# EAGLE design XC9536_trainer (EAGLE 7.5.0)
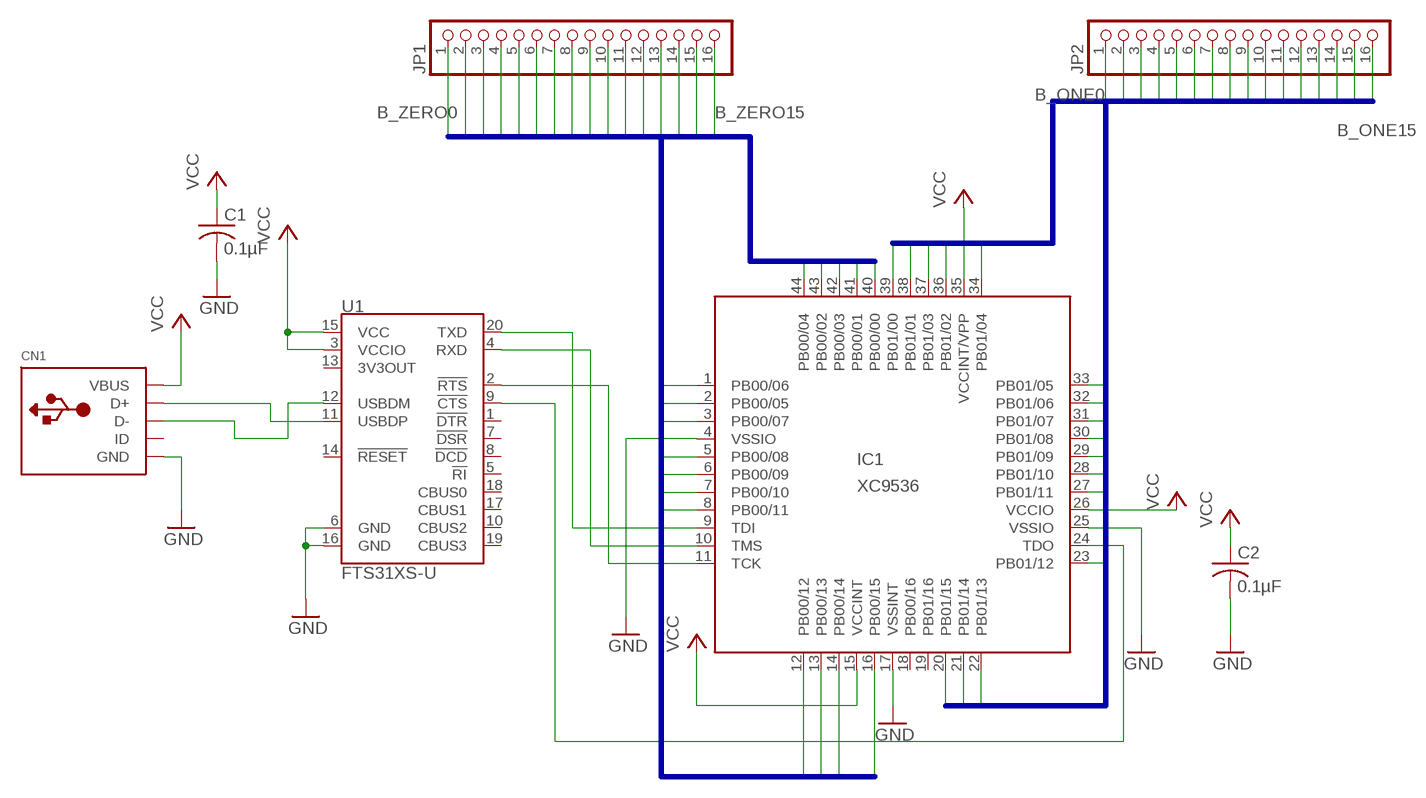
[diagram p0: schematic, sheet 1]

## Parts
C1  0.1µF  C-USC0603K  [C0603K]
C2  0.1µF  C-USC0603K  [C0603K]
CN1  USBMINIBLARGE  [USB-MINIB_LARGER]
IC1  XC9536  XC9536_44VQ  [SQFP-S-10X10-44]
JP1  HEADER-1X16ROUND  [1X16_ROUND]
JP2  HEADER-1X16ROUND  [1X16_ROUND]
U1  FTS31XS-U  FT231XS  [SSOP20_L]

## Nets
B_ONE0: IC1.39(PB01/00) JP2.1
B_ONE1: IC1.38(PB01/01) JP2.2
B_ONE2: IC1.36(PB01/02) JP2.3
B_ONE3: IC1.37(PB01/03) JP2.4
B_ONE4: IC1.34(PB01/04) JP2.5
B_ONE5: IC1.33(PB01/05) JP2.6
B_ONE6: IC1.32(PB01/06) JP2.7
B_ONE7: IC1.31(PB01/07) JP2.8
B_ONE8: IC1.30(PB01/08) JP2.9
B_ONE9: IC1.29(PB01/09) JP2.10
B_ONE10: IC1.28(PB01/10) JP2.11
B_ONE11: IC1.27(PB01/11) JP2.12
B_ONE12: IC1.23(PB01/12) JP2.13
B_ONE13: IC1.22(PB01/13) JP2.14
B_ONE14: IC1.21(PB01/14) JP2.15
B_ONE15: IC1.20(PB01/15) JP2.16
B_ZERO0: IC1.40(PB00/00) JP1.1
B_ZERO1: IC1.41(PB00/01) JP1.2
B_ZERO2: IC1.43(PB00/02) JP1.3
B_ZERO3: IC1.42(PB00/03) JP1.4
B_ZERO4: IC1.44(PB00/04) JP1.5
B_ZERO5: IC1.2(PB00/05) JP1.6
B_ZERO6: IC1.1(PB00/06) JP1.7
B_ZERO7: IC1.3(PB00/07) JP1.8
B_ZERO8: IC1.5(PB00/08) JP1.9
B_ZERO9: IC1.6(PB00/09) JP1.10
B_ZERO10: IC1.7(PB00/10) JP1.11
B_ZERO11: IC1.8(PB00/11) JP1.12
B_ZERO12: IC1.12(PB00/12) JP1.13
B_ZERO13: IC1.13(PB00/13) JP1.14
B_ZERO14: IC1.14(PB00/14) JP1.15
B_ZERO15: IC1.16(PB00/15) JP1.16
GND: C1.2 C2.2 CN1.GND IC1.4(VSSIO) IC1.17(VSSINT) IC1.25(VSSIO) U1.6(GND) U1.16(GND)
N$1: CN1.D+ U1.11(USBDP)
N$2: CN1.D- U1.12(USBDM)
N$4: IC1.9(TDI) U1.20(TXD)
N$5: IC1.10(TMS) U1.4(RXD)
N$6: IC1.11(TCK) U1.2(!RTS)
N$7: IC1.24(TDO) U1.9(!CTS)
VCC: C1.1 C2.1 CN1.VBUS IC1.15(VCCINT) IC1.26(VCCIO) IC1.35(VCCINT/VPP) U1.3(VCCIO) U1.15(VCC)
Unconnected: CN1.ID IC1.18(PB00/16) IC1.19(PB01/16) U1.1(!DTR) U1.5(!RI) U1.7(!DSR) U1.8(!DCD) U1.10(CBUS2) U1.13(3V3OUT) U1.14(!RESET) U1.17(CBUS1) U1.18(CBUS0) U1.19(CBUS3)

## Buses
B_ZERO[0..15]
B_ONE[0..15]

## Library data of the parts
C1 C2 = rcl:C-US: CAPACITOR, American symbol
CN1 = OLED_mod:USB: USB Connectors USBMINIB - Surface Mount Female Mini-B USB Connector 4UConnector: 06564
IC1 = xilinx-xc9:XC9536_44VQ: xc9536_pc44 XC9500 In-System Programmable CPLD Family Auto generated by make-symbol-device-package-bsdl.ulp Rev. 34 Source: xc9536_vq44.bsd; MPN: XC9536-15VQG44C; OC_FARNELL: 1193227; OC_NEWARK: 98K3377
JP1 JP2 = OLED_mod:HEADER-1X16: PIN HEADER
U1 = SparkFun-DigitalIC:FT231X: FTDI FT231X Full Speed USB to Full-handshake UART This USB2.0 Full Speed IC offers a compact bridge to full handshake UART interfaces. The device is a UART, capable of operating up to 3MBaud, with low power consumption (8mA). The FT231X includes the complete FT-X series feature set and enables USB to be added into a system design quickly and easily over a UART interface.; PROD_ID: IC-11524

## Board
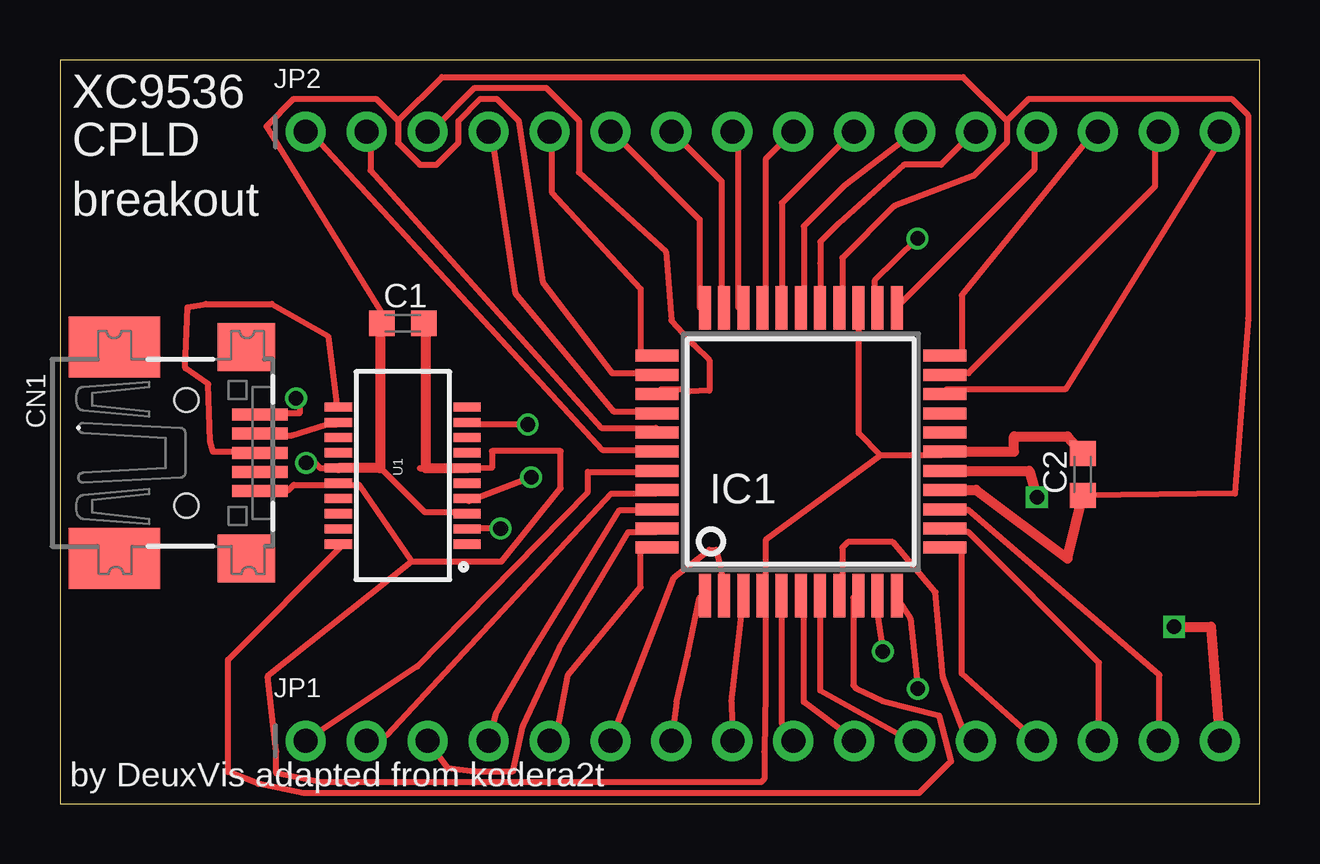
[diagram p1: board, top side]
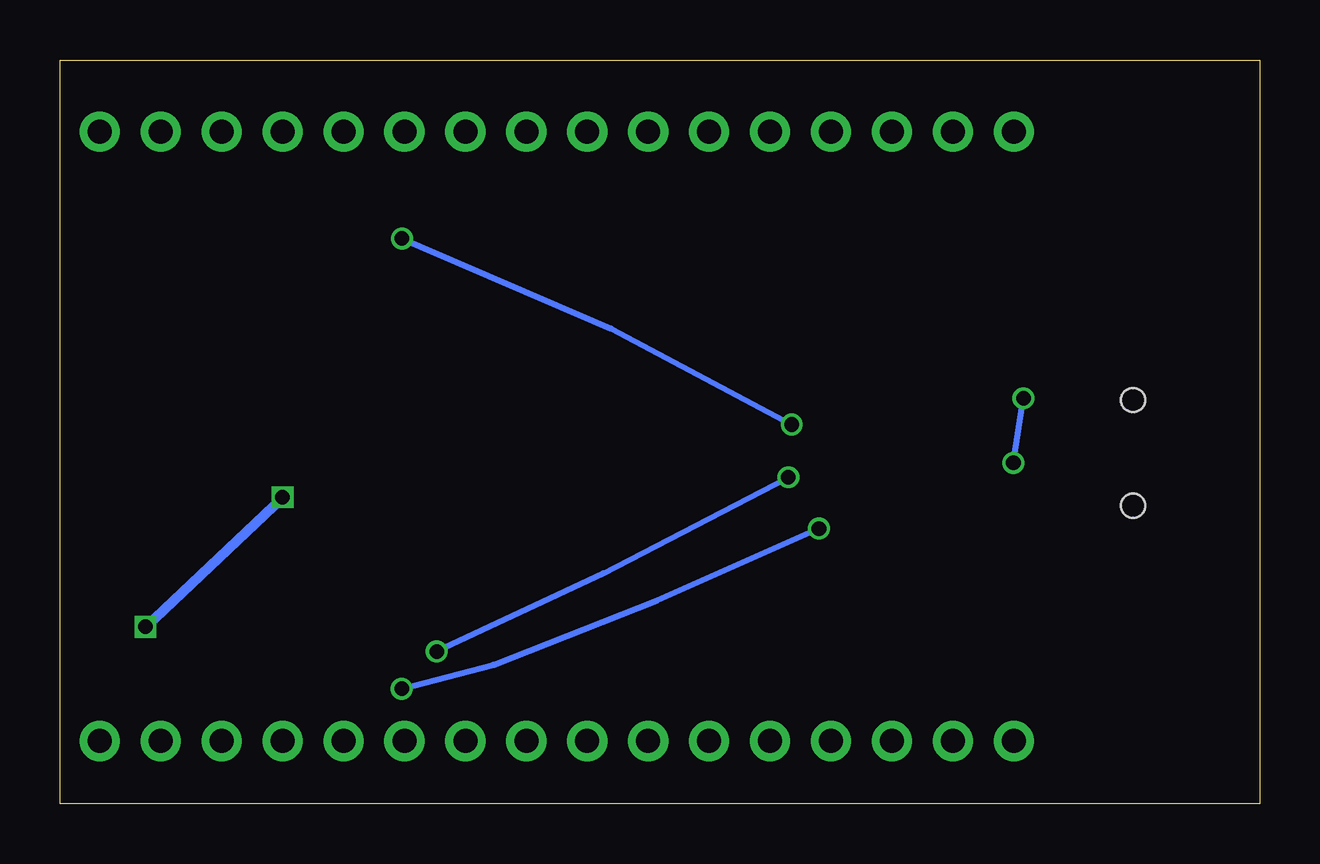
[diagram p2: board, bottom side, seen from below]

Size 50 x 31 mm. Coordinates in mm from the lower left corner, seen from the top.
Outline: 0,0 50,0 50,31 0,31 0,0
Copper layers (1*16): Top 0.035mm / dielectric 1.5mm / Bottom 0.035mm
Design rules "SeeedStudio_2layer_DRU_no_angle_20140221": minimum track width 6mil, minimum drill 12mil, track to track 6mil, track to pad 6mil, pad to pad 6mil, via to via 6mil, smd to smd 0mil, copper to edge 10mil, drill to drill 10mil, minimum pad ring 10mil, minimum via ring 6mil, stop-mask expansion 2mil, vias tented up to drill 100mil, thermal gap 10mil
vRestrict: area 12.4,9.2 to 16.2,18.1; area 25.8,9.6 to 36,19.8

### Footprints (pad centres in the part's own frame; a part is rotated, then mirrored left to right if it is on the bottom)
C0603K = smd 1.05 x 1.08: 1 -0.875,0; 2 0.875,0
USB-MINIB_LARGER = smd 0.5 x 2.308: D+ 0,4.064; D- -0.8,4.064; GND 1.6,4.064; ID 0.8,4.064; VBUS -1.6,4.064 | smd 2.54 x 3.81: GND1 -4.4,-2; GND4 4.4,-2 | smd 2 x 2.4: GND2 -4.4,3.5; GND3 4.4,3.5 | hole 1: -2.2,1; 2.2,1
SQFP-S-10X10-44 = smd 0.5 x 1.8: 1 -4,-6; 2 -3.2,-6; 3 -2.4,-6; 4 -1.6,-6; 5 -0.8,-6; 6 0,-6; 7 0.8,-6; 8 1.6,-6; 9 2.4,-6; 10 3.2,-6; 11 4,-6; 23 4,6; 24 3.2,6; 25 2.4,6; 26 1.6,6; 27 0.8,6; 28 0,6; 29 -0.8,6; 30 -1.6,6; 31 -2.4,6; 32 -3.2,6; 33 -4,6 | smd 1.8 x 0.5: 12 6,-4; 13 6,-3.2; 14 6,-2.4; 15 6,-1.6; 16 6,-0.8; 17 6,0; 18 6,0.8; 19 6,1.6; 20 6,2.4; 21 6,3.2; 22 6,4; 34 -6,4; 35 -6,3.2; 36 -6,2.4; 37 -6,1.6; 38 -6,0.8; 39 -6,0; 40 -6,-0.8; 41 -6,-1.6; 42 -6,-2.4; 43 -6,-3.2; 44 -6,-4
1X16_ROUND = drill 1 pad 1.676: 1 -19.05,0; 2 -16.51,0; 3 -13.97,0; 4 -11.43,0; 5 -8.89,0; 6 -6.35,0; 7 -3.81,0; 8 -1.27,0; 9 1.27,0; 10 3.81,0; 11 6.35,0; 12 8.89,0; 13 11.43,0; 14 13.97,0; 15 16.51,0; 16 19.05,0
SSOP20_L = smd 0.381 x 1.143: 1 -2.857,-2.68; 2 -2.223,-2.68; 3 -1.587,-2.68; 4 -0.953,-2.68; 5 -0.318,-2.68; 6 0.318,-2.68; 7 0.953,-2.68; 8 1.587,-2.68; 9 2.223,-2.68; 10 2.857,-2.68; 11 2.857,2.68; 12 2.223,2.68; 13 1.587,2.68; 14 0.953,2.68; 15 0.318,2.68; 16 -0.318,2.68; 17 -0.953,2.68; 18 -1.587,2.68; 19 -2.223,2.68; 20 -2.857,2.68

### Placement (x,y rotation side)
C1  14.29,20.02 0 top
C2  42.63,13.72 90 top
CN1  4.27,14.62 270 top
IC1  30.88,14.67 0 top
JP1  29.29,2.61 0 top
JP2  29.29,28.01 0 top
U1  14.29,13.67 90 top

### Tracks (layer width: path | path; a pad name or v marks a point on that pad's centre or on a via)
B_ONE0
  Top 0.254: IC1.39 24.84,14.75 22.61,14.75 10.43,28.01 JP2.1
B_ONE1
  Top 0.254: IC1.38 24.84,15.66 22.56,15.66 12.95,26.41 12.95,28.01 JP2.2
B_ONE2
  Top 0.254: IC1.36 25.06,17.26 25.98,17.26 26.21,17.17 27.07,17.21 27.07,18.48 26.44,19.11 25.48,20.14 25.25,23 21.63,26.3 21.63,28.46 20.26,29.83 17.29,29.83 15.46,28.01 JP2.3
B_ONE3
  Top 0.254: IC1.37 24.84,16.35 23.06,16.35 18.98,21.29 17.98,28.01 JP2.4
B_ONE4
  Top 0.254: IC1.34 24.2,18.54 24.2,21.47 20.49,25.49 20.49,28.01 JP2.5
B_ONE5
  Top 0.254: IC1.33 26.66,20.69 26.66,24.35 23.01,28.01 JP2.6
B_ONE6
  Top 0.254: IC1.32 27.58,20.69 27.58,25.95 25.52,28.01 JP2.7
B_ONE7
  Top 0.254: IC1.31 28.26,20.69 28.26,27.78 28.03,28.01 JP2.8
B_ONE8
  Top 0.254: IC1.30 29.41,20.69 29.41,26.86 JP2.9
B_ONE9
  Top 0.254: IC1.29 30.09,20.69 30.09,25.03 33.06,28.01 JP2.10
B_ONE10
  Top 0.254: IC1.28 31.01,20.69 31.01,24.07 32.72,25.78 JP2.11
B_ONE11
  Top 0.254: IC1.27 31.69,20.69 31.69,22.52 31.69,23.42 32.47,24.2 35.17,26.63 36.72,26.63 38.09,28.01 JP2.12
B_ONE12
  Top 0.254: IC1.23 34.89,20.69 40.61,26.42 40.61,28.01 JP2.13
B_ONE13
  Top 0.254: IC1.22 37.59,18.54 37.59,21.2 43.12,28.01 JP2.14
B_ONE14
  Top 0.254: IC1.21 36.95,17.95 37.87,17.95 45.64,25.72 45.64,28.01 JP2.15
B_ONE15
  Top 0.254: IC1.20 36.95,17.26 41.9,17.26 48.15,27.32 48.15,28.01 JP2.16
B_ZERO0
  Top 0.254: IC1.40 24.84,13.83 22,13.83 22,13 14.89,5.72 JP1.1
B_ZERO1
  Top 0.254: IC1.41 24.84,12.92 22.97,12.92 13.63,2.86 13.13,2.72 JP1.2
B_ZERO2
  Top 0.254: IC1.43 24.84,11.32 23.69,11.32 20.81,6.48 19.31,3.26 18.89,1.34 17.29,1.34 16.15,1.49 JP1.3
B_ZERO3
  Top 0.254: IC1.42 24.84,12.23 23.33,12.23 19.66,6.29 18.16,3.72 JP1.4
B_ZERO4
  Top 0.254: IC1.44 24.2,10.63 24.2,9.03 21.18,5.37 20.68,2.72 JP1.5
B_ZERO5
  Top 0.254: IC1.2 27.58,8.8 27.58,9.72 27.35,10.58 27.07,10.58 25.6,9.43 23.19,3.22 JP1.6
B_ZERO6
  Top 0.254: IC1.1 26.66,8.57 26.16,6.17 25.71,4.22 JP1.7
B_ZERO7
  Top 0.254: IC1.3 28.49,8.57 27.99,4.22 JP1.8
B_ZERO8
  Top 0.254: IC1.5 30.09,8.57 30.09,3.39 30.38,2.61 30.51,2.72 JP1.9
B_ZERO9
  Top 0.254: IC1.6 31.01,8.57 31.01,4.23 33.02,2.72 JP1.10
B_ZERO10
  Top 0.254: IC1.7 31.69,8.57 31.69,4.7 35.27,2.72 JP1.11
B_ZERO11
  Top 0.254: IC1.8 32.61,8.8 32.61,10.67 32.84,10.9 34.72,10.9 36.49,8.8 36.81,5.27 37.78,2.72 JP1.12
B_ZERO12
  Top 0.254: JP1.13 37.59,5.42 37.59,10.63 IC1.12
B_ZERO13
  Top 0.254: IC1.13 36.95,11.32 37.87,11.32 43.31,5.87 43.31,3.22 JP1.14
B_ZERO14
  Top 0.254: IC1.14 36.95,12.23 37.87,12.23 45.82,5.36 45.82,2.72 JP1.15
B_ZERO15  (via drill 0.6)
  Top 0.406: IC1.16 40.41,13.87 v40.72,12.77 | v46.44,7.37 47.98,7.37 JP1.16
  Bottom 0.406: v40.72,12.77 v46.44,7.37
GND
  Top 0.254: CN1.GND 8.38,13.06 9.52,13.06 9.75,13.29 11.55,13.29 U1.16 11.77,13.29 12.46,13.29 14.66,10.09 | 14.66,10.09 18.4,10.09 20.87,13.15 20.87,14.7 18,14.7 18,14 15.01,13.98 17.03,13.98 U1.6 | 34.21,14.52 29.41,10.99 29.41,8.8 IC1.4 29.41,8.57 29.41,4.63 29.36,2.17 29.36,1.03 29.22,0.89 10.89,0.89 9.02,1.26 9.02,2.17 8.66,5.32 14.66,10.09 | 34.21,14.52 36.72,14.52 IC1.17 | 34.21,14.52 33.29,15.43 33.29,20.46 IC1.25
  Top 0.406: C1.2 15.24,20.02 15.24,13.99 U1.6 | IC1.17 39.77,14.67 39.77,15.3 41.99,15.3 C2.2
N$1
  Top 0.254: U1.11 11.55,16.49 11.17,19.49 8.83,20.83 6.09,20.83 5.31,20.69 5.23,18.15 6.18,17.48 6.27,15.09 6.38,14.66 8.15,14.66 CN1.D+
N$2
  Top 0.254: U1.12 11.55,15.8 11.12,15.8 9.66,15.35 8.38,15.35 CN1.D-
N$4
  Top 0.254: U1.20 11.77,10.77 7,6 7,1.32 8.27,0.82 10.16,0.43 35.81,0.43 37.14,1.76 36.64,3.67 34.25,4.29 33.2,4.79 33.06,4.93 33.06,8.57 IC1.9
N$5  (via drill 0.61)
  Top 0.254: v19.64,13.6 17.03,12.6 U1.4 | v34.3,6.34 33.98,8.57 IC1.10
  Bottom 0.254: v19.64,13.6 27.35,9.6 v34.3,6.34
N$6  (via drill 0.61)
  Top 0.254: v18.36,11.46 17.03,11.46 U1.2 | v35.76,4.79 35.44,7.71 34.89,8.57 IC1.11
  Bottom 0.254: v18.36,11.46 25.12,8.46 31.93,5.79 v35.76,4.79
N$7  (via drill 0.61)
  Top 0.254: v19.5,15.8 17.03,15.8 U1.9 | v35.74,23.56 33.98,21.83 33.98,20.69 IC1.24
  Bottom 0.254: v19.5,15.8 27.03,19.8 v35.74,23.56
VCC  (via drill 0.61)
  Top 0.254: U1.3 16.8,12.15 15.2,12.15 13.38,13.98 13.34,13.99 | 14.09,28.46 14.09,27.55 15.01,26.63 15.69,26.63 16.6,27.55 16.6,28.46 17.52,29.38 18.2,29.38 19.12,28.46 20.12,21.75 23.02,17.95 24.84,17.95 IC1.35 | 14.09,28.46 13.18,29.38 9.75,29.38 8.6,28.23 13.6,20.15 C1.1 | 39.47,28.46 39.47,27.55 38.09,26.18 34.77,24.91 32.61,22.75 32.61,20.69 IC1.26 | 39.47,28.46 37.64,30.29 15.92,30.29 14.09,28.46 | v9.84,16.9 9.99,16.53 9.99,16.26 8.38,16.26 CN1.VBUS | v10.26,14.2 10.63,14.2 10.86,13.98 11.55,13.98 U1.15 | 39.47,28.46 40.38,29.38 48.84,29.38 49.52,28.69 49.52,20.23 48.97,12.92 C2.1
  Top 0.406: C1.1 13.34,20.02 13.34,13.99 U1.15 | IC1.15 38.18,13.08 41.99,10.21 C2.1 42.63,12.75
  Bottom 0.254: v10.26,14.2 v9.84,16.9

### Text on the board
tSilk: XC9536 | CPLD | breakout
_tsilk: by DeuxVis adapted from kodera2t